# Altium project Sofia_Master.PrjPcb
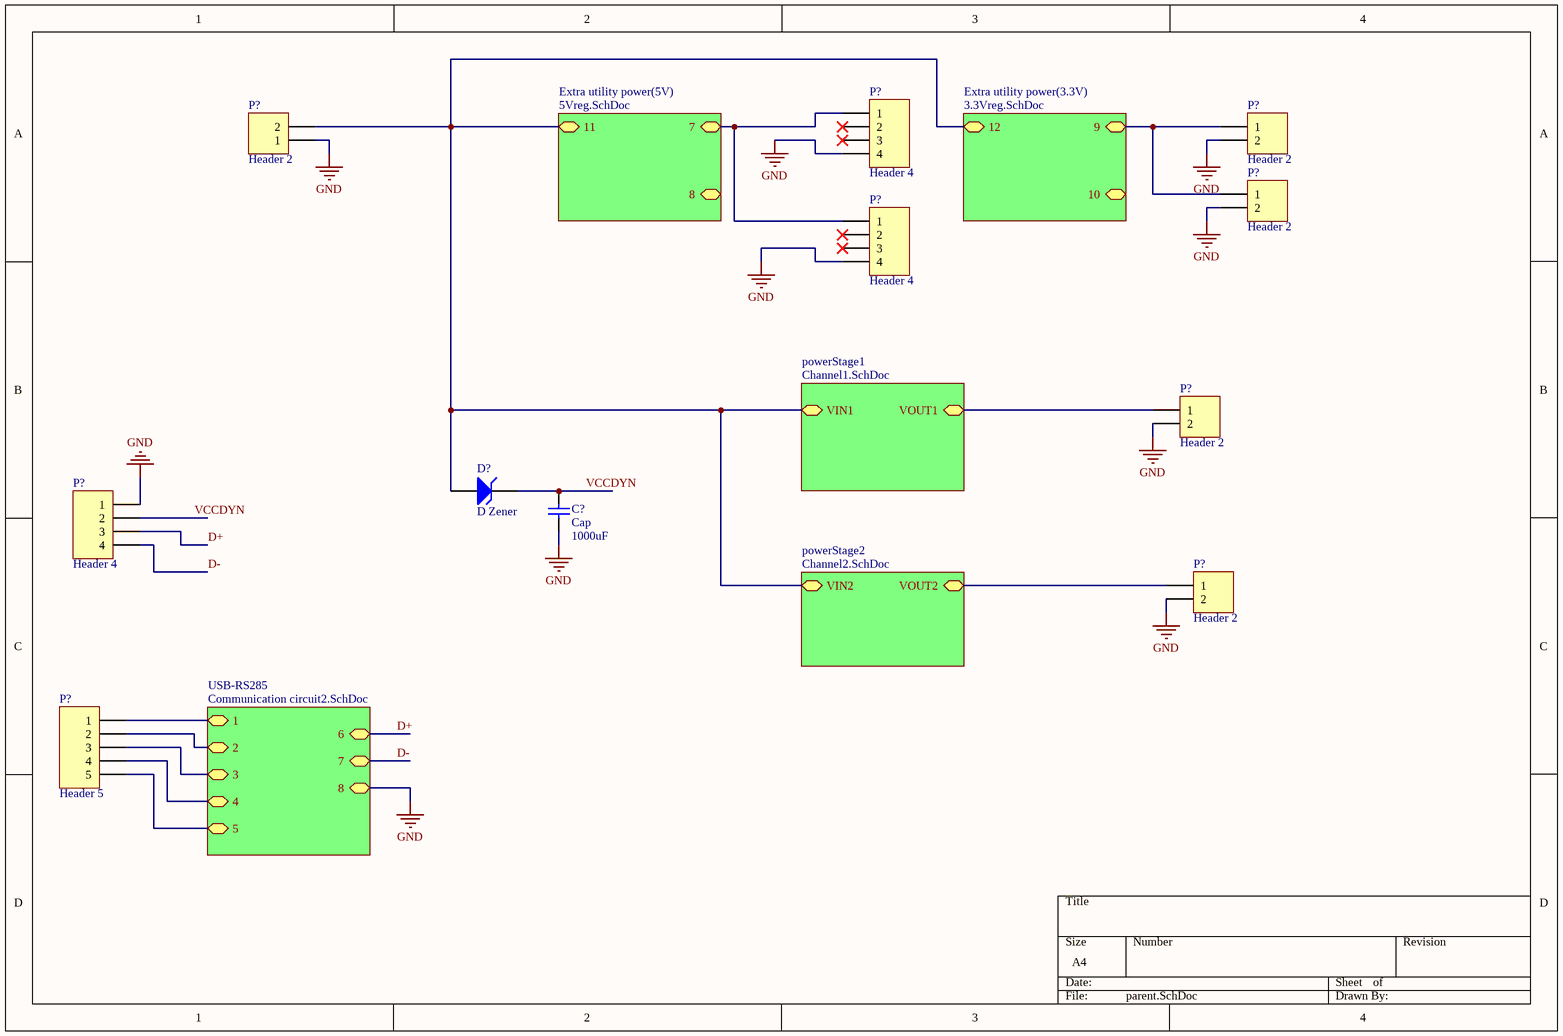
[diagram p0: parent.SchDoc]
4 sheets, 55 parts. Net scope: global (net labels, ports and power ports of the same name join across sheets).
Board file: Power.PcbDoc
Sheets:
  parent.SchDoc
    powerStage2 = Channel2.SchDoc
    USB-RS285 = Communication circuit2.SchDoc
    Extra utility power(3.3V) = 3.3Vreg.SchDoc

## Sheet parent.SchDoc
size A4

### Parts
(Parts that share a designator on the sheet are numbered #1, #2 ... from top to bottom, then left to right.)
C?#1  Cap  value 1000uF  [1608[0603]]
D?#1  D Zener  [SMB]
P?#1  Header 4  [A-USB-A/SMT]
P?#2  Header 2  [HDR1X2]
P?#3  Header 2  [HDR1X2]
P?#4  Header 2  [HDR1X2]
P?#5  Header 4  [A-USB-A/SMT]
P?#6  Header 2  [HDR1X2]
P?#7  Header 4  [HDR1X4]
P?#8  Header 2  [HDR1X2]
P?#9  Header 5  [481900001]

### Sub-sheets
Extra utility power(3.3V) = 3.3Vreg.SchDoc: 9, 10, 12
Extra utility power(5V) = 5Vreg.SchDoc (file not in this document): 7, 8, 11
powerStage1 = Channel1.SchDoc (file not in this document): VIN1, VOUT1
powerStage2 = Channel2.SchDoc: VIN2, VOUT2
USB-RS285 = Communication circuit2.SchDoc: 1, 2, 3, 4, 6, 7, 8, 5

### Nets
GND: C?#1.2 P?#1.4 P?#2.2 P?#3.1 P?#4.2 P?#5.4 P?#6.2 P?#7.1 P?#8.2 ; sheet USB-RS285/8  [project net SGND]
D+: P?#7.3 ; sheet USB-RS285/6
D-: P?#7.4 ; sheet USB-RS285/7
VCCDYN: C?#1.1 D?#1.2(K) P?#7.2
NetD?#1_1: D?#1.1(A) P?#3.2 ; sheet powerStage1/VIN1, sheet powerStage2/VIN2, sheet Extra utility power(5V)/11, sheet Extra utility power(3.3V)/12
NetP?#1_1: P?#1.1 P?#5.1 ; sheet Extra utility power(5V)/7
NetP?#2_1: P?#2.1 P?#4.1 ; sheet Extra utility power(3.3V)/9
NetP?#6_1: P?#6.1 ; sheet powerStage1/VOUT1
NetP?#8_1: P?#8.1 ; sheet powerStage2/VOUT2
NetP?#9_1: P?#9.1 ; sheet USB-RS285/1
NetP?#9_2: P?#9.2 ; sheet USB-RS285/2
NetP?#9_3: P?#9.3 ; sheet USB-RS285/3
NetP?#9_4: P?#9.4 ; sheet USB-RS285/4
NetP?#9_5: P?#9.5 ; sheet USB-RS285/5

Not connected (* = marked no-connect by the designer): P?#1 2* 3*; P?#5 2* 3*

### Library data of the parts
C?#1 = Cap: Capacitor; Published: 8-Jun-2000; LatestRevisionDate: 17-Jul-2002; LatestRevisionNote: Re-released for DXP Platform.; PackageReference: RAD-0.3; Publisher: Altium Limited; PackageDescription: Radial Cap, Thru-Hole; 2 Leads; 0.3 in Pin Spacing
D?#1 = D Zener: Zener Diode; Published: 8-Jun-2000; LatestRevisionDate: 17-Jul-2002; LatestRevisionNote: Re-released for DXP Platform.; PackageReference: DIODE-0.7; Publisher: Altium Limited; PackageDescription: Diode, Thru-Hole; 2 Leads; 0.7 in Pin Spacing
P?#1 P?#5 P?#7 = Header 4: Header, 4-Pin; LatestRevisionDate: 17-Jul-2002; LatestRevisionNote: Re-released for DXP Platform.; Publisher: Altium Limited
P?#2-P?#4 P?#6 P?#8 = Header 2: Header, 2-Pin; LatestRevisionDate: 17-Jul-2002; LatestRevisionNote: Re-released for DXP Platform.; Publisher: Altium Limited
P?#9 = Header 5: Header, 5-Pin; LatestRevisionDate: 17-Jul-2002; LatestRevisionNote: Re-released for DXP Platform.; Publisher: Altium Limited

## Sheet Channel2.SchDoc
size A3
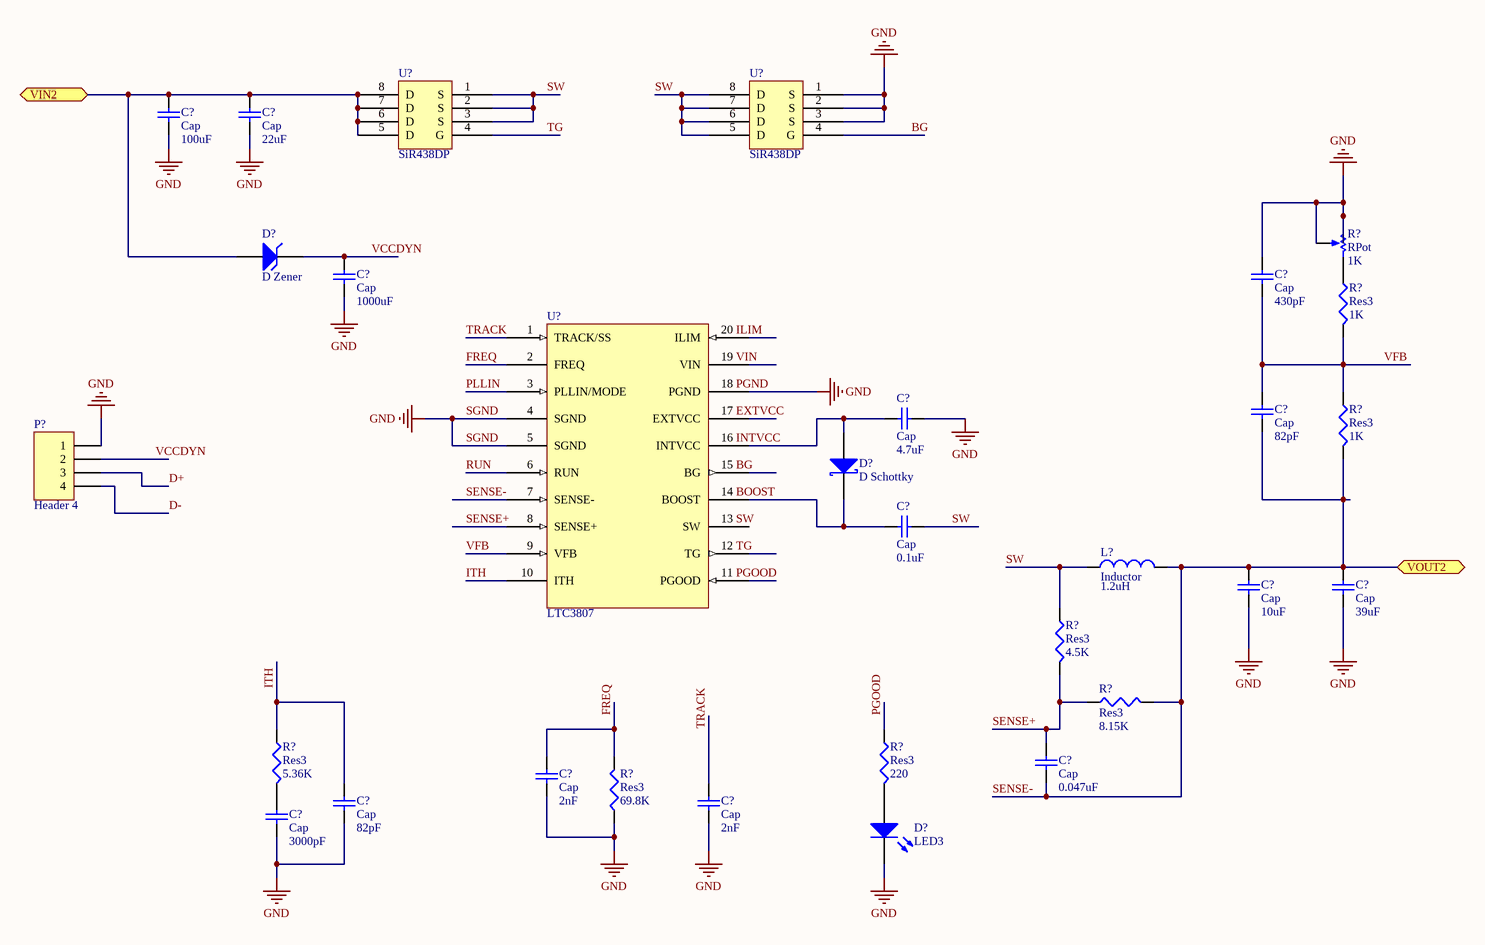
[diagram p1: Channel2.SchDoc]

### Parts
(Parts that share a designator on the sheet are numbered #1, #2 ... from top to bottom, then left to right.)
C?#2  Cap  value 100uF  [1608[0603]]
C?#3  Cap  value 22uF  [1608[0603]]
C?#4  Cap  value 1000uF  [1608[0603]]
C?#5  Cap  value 430pF  [1608[0603]]
C?#6  Cap  value 82pF  [1608[0603]]
C?#7  Cap  value 4.7uF  [1608[0603]]
C?#8  Cap  value 0.1uF  [1608[0603]]
C?#9  Cap  value 10uF  [1608[0603]]
C?#10  Cap  value 39uF  [1608[0603]]
C?#11  Cap  value 0.047uF  [1608[0603]]
C?#12  Cap  value 2nF  [1608[0603]]
C?#13  Cap  value 3000pF  [1608[0603]]
C?#14  Cap  value 82pF  [1608[0603]]
C?#15  Cap  value 2nF  [J1-0603]
D?#2  D Zener  [SMB]
D?#3  D Schottky  [SMB]
D?#4  LED3  [3.5X2.8X1.9]
L?#1  Inductor  value 1.2uH  [INDM135125X35N]
P?#10  Header 4  [HDR1X4]
R?#1  RPot  value 1K  [VR5]
R?#2  Res3  value 1K  [J1-0603]
R?#3  Res3  value 1K  [J1-0603]
R?#4  Res3  value 4.5K  [J1-0603]
R?#5  Res3  value 8.15K  [J1-0603]
R?#6  Res3  value 220  [J1-0603]
R?#7  Res3  value 5.36K  [J1-0603]
R?#8  Res3  value 69.8K  [J1-0603]
U?#1  SiR438DP  [SO-8-POWERPAK]
U?#2  SiR438DP  [SO-8-POWERPAK]
U?#3  LTC3807  [TSOP65P660X120_HS-21N]

### Ports
VIN2, VOUT2

### Nets
SGND: C?#2.1 C?#3.1 C?#4.2 C?#5.1 C?#7.1 C?#9.1 C?#10.1 C?#12.1 C?#13.2 C?#14.1 C?#15.1 D?#4.2(K) P?#10.1 R?#1.2(BOT) R?#1.3(TAP) R?#8.1 U?#2.1(S) U?#2.2(S) U?#2.3(S) U?#3.4(SGND) U?#3.5(SGND) U?#3.18(PGND)  [also labelled GND]
BG: U?#2.4(G)
D+: P?#10.3
D-: P?#10.4
FREQ: C?#12.2 R?#8.2 U?#3.2(FREQ)
ITH: C?#14.2 R?#7.2 U?#3.10(ITH)
PGOOD: R?#6.1
PLLIN: U?#3.3(PLLIN/MODE)
RUN: U?#3.6(RUN)
SENSE+: C?#11.1 R?#4.2 R?#5.1 U?#3.8(SENSE+)
SENSE-: C?#6.1 C?#9.2 C?#10.2 C?#11.2 L?#1.2 R?#3.2 R?#5.2 U?#3.7(SENSE-) ; port VOUT2
SW: C?#8.1 L?#1.1 R?#4.1 U?#1.1(S) U?#1.2(S) U?#1.3(S) U?#2.5(D) U?#2.6(D) U?#2.7(D) U?#2.8(D)
TG: U?#1.4(G)
TRACK: C?#15.2 U?#3.1(TRACK/SS)
VCCDYN: C?#4.1 D?#2.2(K) P?#10.2
VFB: C?#5.2 C?#6.2 R?#2.2 R?#3.1 U?#3.9(VFB)
NetC?#2_2: C?#2.2 C?#3.2 D?#2.1(A) U?#1.5(D) U?#1.6(D) U?#1.7(D) U?#1.8(D) ; port VIN2
NetC?#7_2: C?#7.2 D?#3.1(A) U?#3.16(INTVCC)
NetC?#8_2: C?#8.2 D?#3.2(K) U?#3.14(BOOST)
NetC?#13_1: C?#13.1 R?#7.1
NetD?#4_1: D?#4.1(A) R?#6.2
NetR?#1_1: R?#1.1(TOP) R?#2.1

Not connected (* = marked no-connect by the designer): U?#3 11(PGOOD) 12(TG) 13(SW) 15(BG) 17(EXTVCC) 19(VIN) 20(ILIM)

### Notes on the sheet
- Labels drawn without touching a wire or pin: BG, BOOST, EXTVCC, ILIM, INTVCC, PGND, PGOOD, SW, TG, VIN

### Library data of the parts
C?#2-C?#15 = Cap: Capacitor; Published: 8-Jun-2000; LatestRevisionDate: 17-Jul-2002; LatestRevisionNote: Re-released for DXP Platform.; PackageReference: RAD-0.3; Publisher: Altium Limited; PackageDescription: Radial Cap, Thru-Hole; 2 Leads; 0.3 in Pin Spacing
D?#2 = D Zener: Zener Diode; Published: 8-Jun-2000; LatestRevisionDate: 17-Jul-2002; LatestRevisionNote: Re-released for DXP Platform.; PackageReference: DIODE-0.7; Publisher: Altium Limited; PackageDescription: Diode, Thru-Hole; 2 Leads; 0.7 in Pin Spacing
D?#3 = D Schottky: Schottky Diode; Published: 8-Jun-2000; LatestRevisionDate: 17-Jul-2002; LatestRevisionNote: Re-released for DXP Platform.; PackageReference: SMB; Publisher: Altium Limited; PackageDescription: DO-214-AA/SMB; 2 C-Bend Leads; Body 5.3 x 3.6 mm, inc. leads (LxW); Code_JEDEC: DO-214-AA
D?#4 = LED3: Typical BLUE SiC LED; Published: 8-Jun-2000; LatestRevisionDate: 17-Dec-2003; LatestRevisionNote: PCB Footprint replaced.; DatasheetVersion: 16-Apr-2002; PackageVersion: 16-Apr-2002; PackageReference: 3.5X2.8X1.9; Publisher: Altium Limited; PackageDescription: SM LED; 2 C-Bend Leads; Body 3.5 x 2.8 x 1.9 mm, inc leads (LxWxH typ)
L?#1 = Inductor: Code_IEC: 1005; Published: 8-Jun-2000; LatestRevisionDate: 29-May-2009; LatestRevisionNote: IPC-7351 Footprint Added.; PackageReference: 0402-A; Publisher: Altium Limited; PackageDescription: Chip Inductor; Code_JEITA: 0402
P?#10 = Header 4: Header, 4-Pin; LatestRevisionDate: 17-Jul-2002; LatestRevisionNote: Re-released for DXP Platform.; Publisher: Altium Limited
R?#1 = RPot: Potentiometer; Sim Note: Enter the Resistance value and the set point into parameter fields.; Set Position: 0.5; Published: 8-Jun-2000; LatestRevisionDate: 17-Jul-2002; LatestRevisionNote: Re-released for DXP Platform.; PackageReference: VR5; Publisher: Altium Limited; PackageDescription: Variable Resistor, Thru-Hole; 3 Leads
R?#2-R?#8 = Res3: Resistor; Published: 8-Jun-2000; LatestRevisionDate: 29-May-2009; LatestRevisionNote: IPC-7351 Footprint Added.; PackageReference: J1-0603; Publisher: Altium Limited; PackageDescription: Chip Resistor
U?#3 = Component_1

## Sheet Communication circuit2.SchDoc
size A4
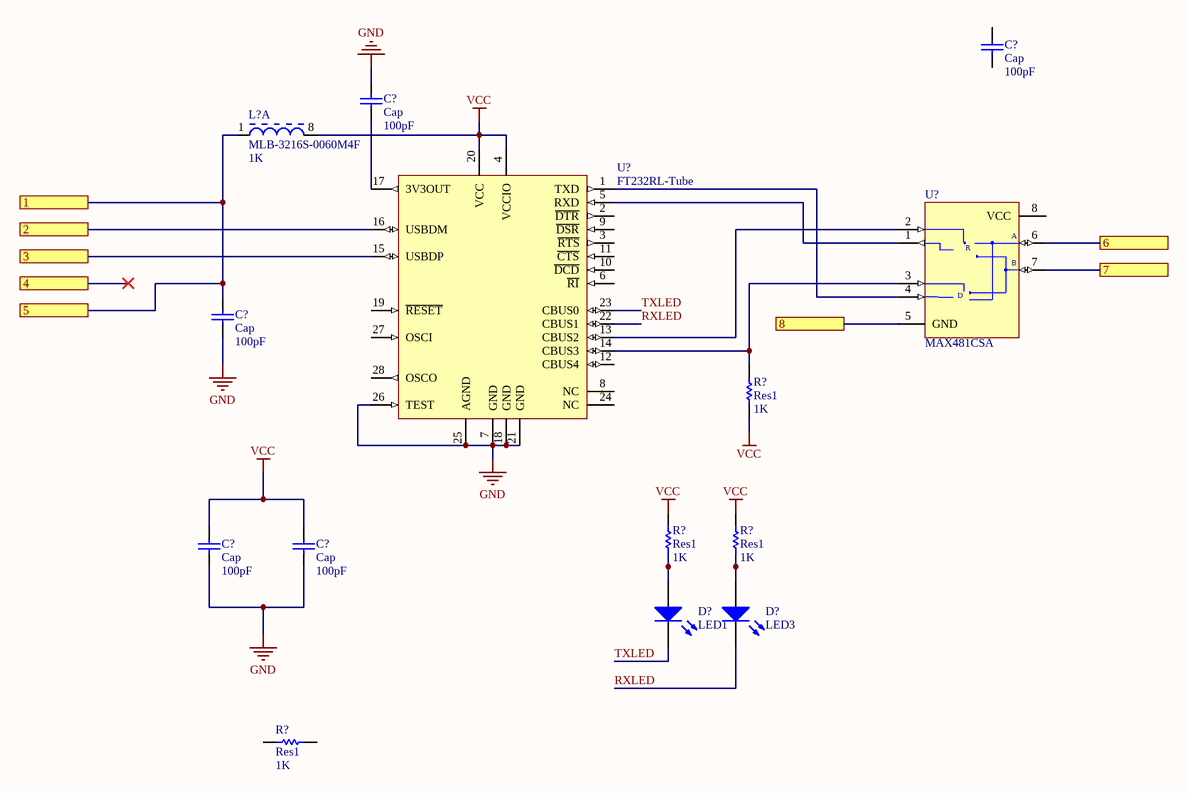
[diagram p2: Communication circuit2.SchDoc]

### Parts
(Parts that share a designator on the sheet are numbered #1, #2 ... from top to bottom, then left to right.)
C?#16  Cap  value 100pF  [RAD-0.3]
C?#17  Cap  value 100pF  [RAD-0.3]
C?#18  Cap  value 100pF  [RAD-0.3]
C?#19  Cap  value 100pF  [RAD-0.3]
C?#20  Cap  value 100pF  [RAD-0.3]
D?#5  LED1  [LED-1]
D?#6  LED3  [3.5X2.8X1.9]
L?#2  MLB-3216S-0060M4F  value 1K  [0805]  (part A of 4)
R?#9  Res1  value 1K  [AXIAL-0.3]
R?#10  Res1  value 1K  [AXIAL-0.3]
R?#11  Res1  value 1K  [AXIAL-0.3]
R?#12  Res1  value 1K  [AXIAL-0.3]
U?#4  FT232RL-Tube  [SSOP-28_N]
U?#5  MAX481CSA  [NSO8_N]

### Ports
1, 2, 3, 4, 5, 6, 7, 8

### Nets
GND: C?#17.2 C?#18.1 C?#19.1 C?#20.1 U?#4.7(GND) U?#4.18(GND) U?#4.21(GND) U?#4.25(AGND) U?#4.26(TEST)  [project net SGND]
VCC: C?#19.2 C?#20.2 L?#2.8 R?#9.2 R?#10.1 R?#11.1 U?#4.4(VCCIO) U?#4.20(VCC)
RXLED: D?#6.2(K) U?#4.22(CBUS1)
TXLED: D?#5.2(K) U?#4.23(CBUS0)
NetC?#17_1: C?#17.1 U?#4.17(3V3OUT)
NetC?#18_2: C?#18.2 L?#2.1 ; port 1, port 5
NetD?#5_1: D?#5.1(A) R?#10.2
NetD?#6_1: D?#6.1(A) R?#11.2
NetR?#9_1: R?#9.1 U?#4.14(CBUS3) U?#5.3(DE)
NetU?#4_1: U?#4.1(TXD) U?#5.4(DI)
NetU?#4_5: U?#4.5(RXD) U?#5.1(RO)
NetU?#4_13: U?#4.13(CBUS2) U?#5.2(~{RE})
NetU?#4_15: U?#4.15(USBDP) ; port 3
NetU?#4_16: U?#4.16(USBDM) ; port 2
NetU?#5_5: U?#5.5(GND) ; port 8
NetU?#5_6: U?#5.6(A) ; port 6
NetU?#5_7: U?#5.7(B) ; port 7

Not connected (* = marked no-connect by the designer): C?#16 1 2; R?#12 1 2; U?#4 2(~{DTR}) 3(~{RTS}) 6(~{RI}) 8(NC) 9(~{DSR}) 10(~{DCD}) 11(~{CTS}) 12(CBUS4) 19(~{RESET}) 24(NC) 27(OSCI) 28(OSCO); U?#5 8(VCC)

### Notes on the sheet
- (in symbol MAX481CSA) R; D

### Library data of the parts
C?#16-C?#20 = Cap: Capacitor; Published: 8-Jun-2000; LatestRevisionDate: 17-Jul-2002; LatestRevisionNote: Re-released for DXP Platform.; PackageReference: RAD-0.3; Publisher: Altium Limited; PackageDescription: Radial Cap, Thru-Hole; 2 Leads; 0.3 in Pin Spacing
D?#5 = LED1: Typical RED GaAs LED; Published: 8-Jun-2000; LatestRevisionDate: 08-Jul-2005; LatestRevisionNote: Mech Layer 1 removed.; PackageReference: LED-1; Publisher: Altium Limited; PackageDescription: LED; 2 Leads
D?#6 = LED3: Typical BLUE SiC LED; Published: 8-Jun-2000; LatestRevisionDate: 17-Dec-2003; LatestRevisionNote: PCB Footprint replaced.; DatasheetVersion: 16-Apr-2002; PackageVersion: 16-Apr-2002; PackageReference: 3.5X2.8X1.9; Publisher: Altium Limited; PackageDescription: SM LED; 2 C-Bend Leads; Body 3.5 x 2.8 x 1.9 mm, inc leads (LxWxH typ)
L?#2 = MLB-3216S-0060M4F: Ferrite Bead (4x1608 = 3216) SM Chip Array, 8 Leads, 60Ohm, 300mA; PCB_Layout: Complies with manufacturer's recommendation.; Sim Note: Enter the Resistance value into parameter field.; Published: 26-Sep-2008; DatasheetVersion: Mar-2007; PackageVersion: Mar-2007; PackageReference: 321608; Publisher: Altium Limited; PackageDescription: 4-Line Ferrite Bead Chip Array, (1206); SM; 8 Leads; Body 3.2 x 1.5 x 0.8mm (LxWxH typ); ComponentLink1Description: Manufacturer Link; ComponentLink1URL: http://www.kitagawa.de/; ComponentLink2Description: Datasheet; ComponentLink2URL: http://www.kitagawa.de/database/ind/in025027.pdf
R?#9-R?#12 = Res1: Resistor; Published: 8-Jun-2000; LatestRevisionDate: 17-Jul-2002; LatestRevisionNote: Re-released for DXP Platform.; PackageReference: AXIAL-0.3; Publisher: Altium Limited; PackageDescription: Axial Device, Thru-Hole; 2 Leads; 0.3 in Pin Spacing
U?#4 = FT232RL-Tube: USB UART Asynchronous Serial Data Transfer Chip, SSOP-28, Tube; Published: 19-Aug-2010; DatasheetVersion: ver 2.07, Jul-2010; PackageVersion: 2010; PackageReference: SSOP-28; Publisher: Altium Limited; PackageDescription: 28-Pin Small Outline Package 0.65 mm Pitch; ComponentLink1Description: Manufacturer Link; ComponentLink1URL: http://www.ftdichip.com/Products/ICs/FT232R.htm; ComponentLink2Description: Datasheet; ComponentLink2URL: http://www.ftdichip.com/Support/Documents/DataSheets/ICs/DS_FT232R.pdf
U?#5 = MAX481CSA: Low-Power, Slew-Rate-Limited RS-485/RS-422 Transceiver; Published: 16-Jan-2001; LatestRevisionDate: 13-Apr-2006; LatestRevisionNote: IPC-7351 Footprint Added.; DatasheetVersion: Feb-1996; PackageReference: NSO8; Publisher: Altium Limited; PackageDescription: 8-Pin Small Outline Integrated Circuit 1.27 mm Pitch; Code_JEDEC: MS-012-AA; Code_IPC: SOIC127P600-8; ComponentLink1Description: Manufacturer Link; ComponentLink1URL: http://www.maxim-ic.com/; ComponentLink2Description: Datasheet; ComponentLink2URL: http://pdfserv.maxim-ic.com/en/ds/MAX1487-MAX491.pdf

## Sheet 3.3Vreg.SchDoc
size A4
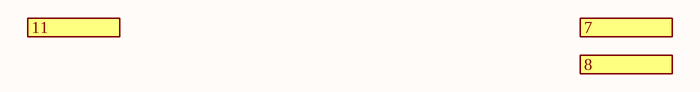
[diagram p3: 3.3Vreg.SchDoc]

### Ports
7, 8, 11

## Nets that join several sheets
SGND: parent (9 pins), Channel2 (22 pins), Communication circuit2 (9 pins)
D+: parent (P?#7.3), Channel2 (P?#10.3)
D-: parent (P?#7.4), Channel2 (P?#10.4)
VCCDYN: parent (C?#1.1 D?#1.2 P?#7.2), Channel2 (C?#4.1 D?#2.2 P?#10.2)